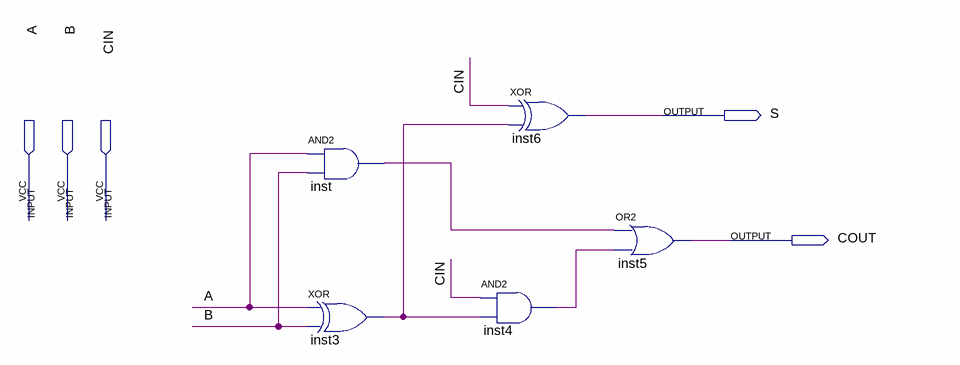
[diagram p0: schematic sheet]
// Quartus schematic fulladder.bdf as structural Verilog: 5 symbols, 5 pins
module fulladder (
  input  A,
  input  B,
  input  CIN,
  output S,
  output COUT
);

  wire inst3_out, inst4_out, inst_out;

  and inst (inst_out, A, B);
  xor inst3 (inst3_out, A, B);
  and inst4 (inst4_out, CIN, inst3_out);
  xor inst6 (S, CIN, inst3_out);
  or inst5 (COUT, inst_out, inst4_out);
endmodule
